# EAGLE design V1 (EAGLE 9.6.2)
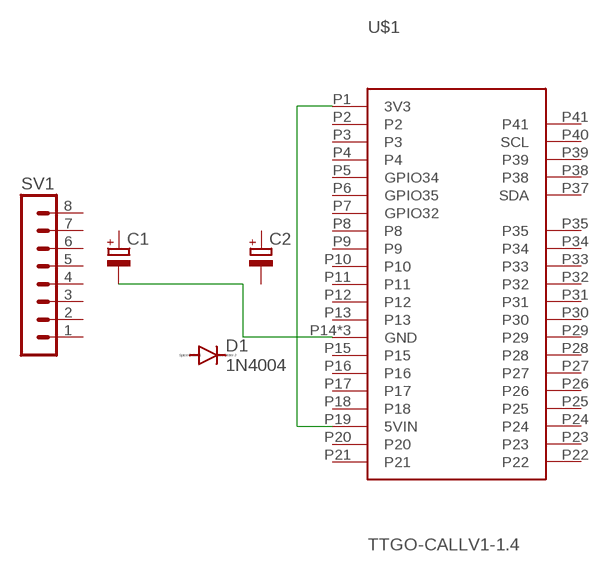
[diagram p0: schematic, sheet 1]

## Parts
C1  CPOL-EUE3.5-8  [E3,5-8]
C2  CPOL-EUE3.5-8  [E3,5-8]
D1  1N4004  [DO41-10]
SV1  MA08-1  [MA08-1]
U$1  TTGO-CALLV1-1.4  [TTGO-CALLV11.4]

## Nets
N$1: U$1.P1(3V3) U$1.P19(5VIN)
N$2: C1.- U$1.P14(GND) U$1.P36(GND) U$1.P42(GND)
Unconnected: C1.+ C2.+ C2.- D1.A D1.C SV1.1 SV1.2 SV1.3 SV1.4 SV1.5 SV1.6 SV1.7 SV1.8 U$1.P2 U$1.P3 U$1.P4 U$1.P5(GPIO34) U$1.P6(GPIO35) U$1.P7(GPIO32) U$1.P8 U$1.P9 U$1.P10 U$1.P11 U$1.P12 U$1.P13 U$1.P15 U$1.P16 U$1.P17 U$1.P18 U$1.P20 U$1.P21 U$1.P22 U$1.P23 U$1.P24 U$1.P25 U$1.P26 U$1.P27 U$1.P28 U$1.P29 U$1.P30 U$1.P31 U$1.P32 U$1.P33 U$1.P34 U$1.P35 U$1.P37(SDA) U$1.P38 U$1.P39 U$1.P40(SCL) U$1.P41

## Library data of the parts
C1 C2 = rcl:CPOL-EU: POLARIZED CAPACITOR, European symbol; SPICEPREFIX: C
D1 = diode:1N4004: DIODE general purpose rectifier, 1 A
SV1 = con-lstb:MA08-1: PIN HEADER; OC_FARNELL: unknown; OC_NEWARK: unknown
U$1 = TTGO T-Call V1.4:TTGO-CALLV1-1.4

## Board
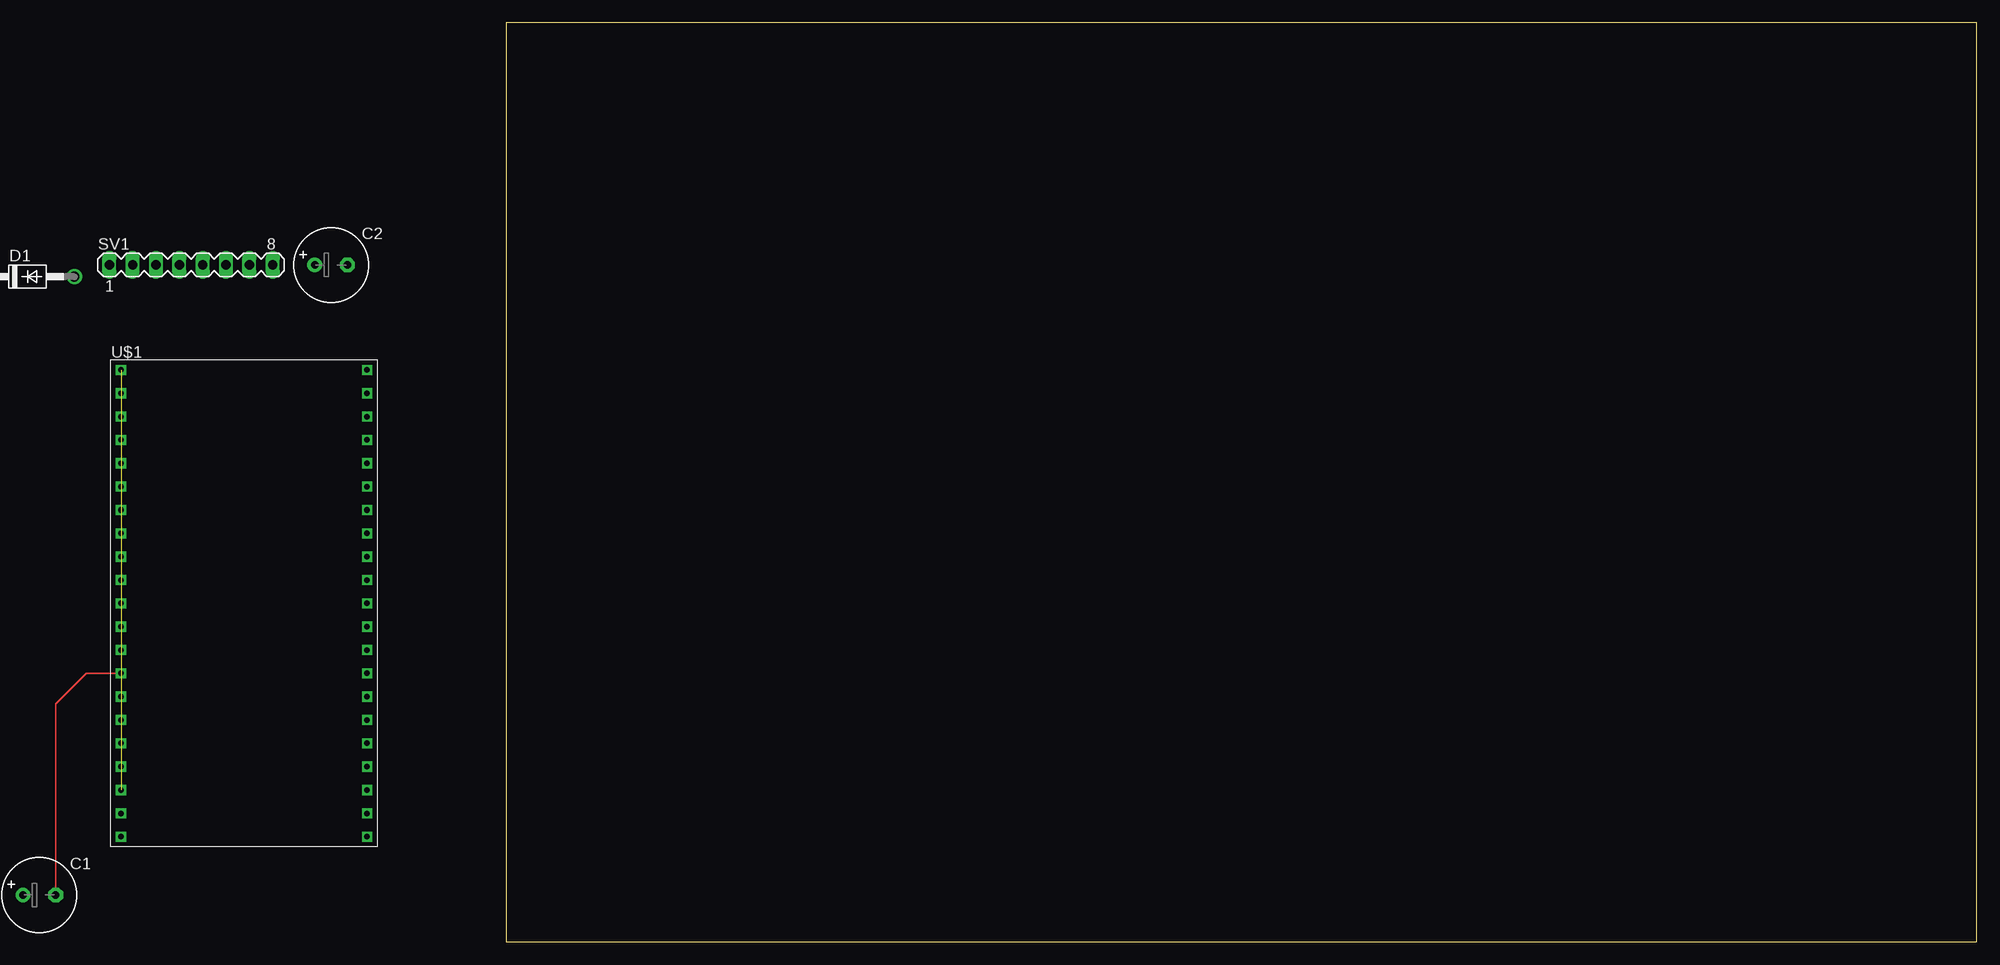
[diagram p1: board, top side]
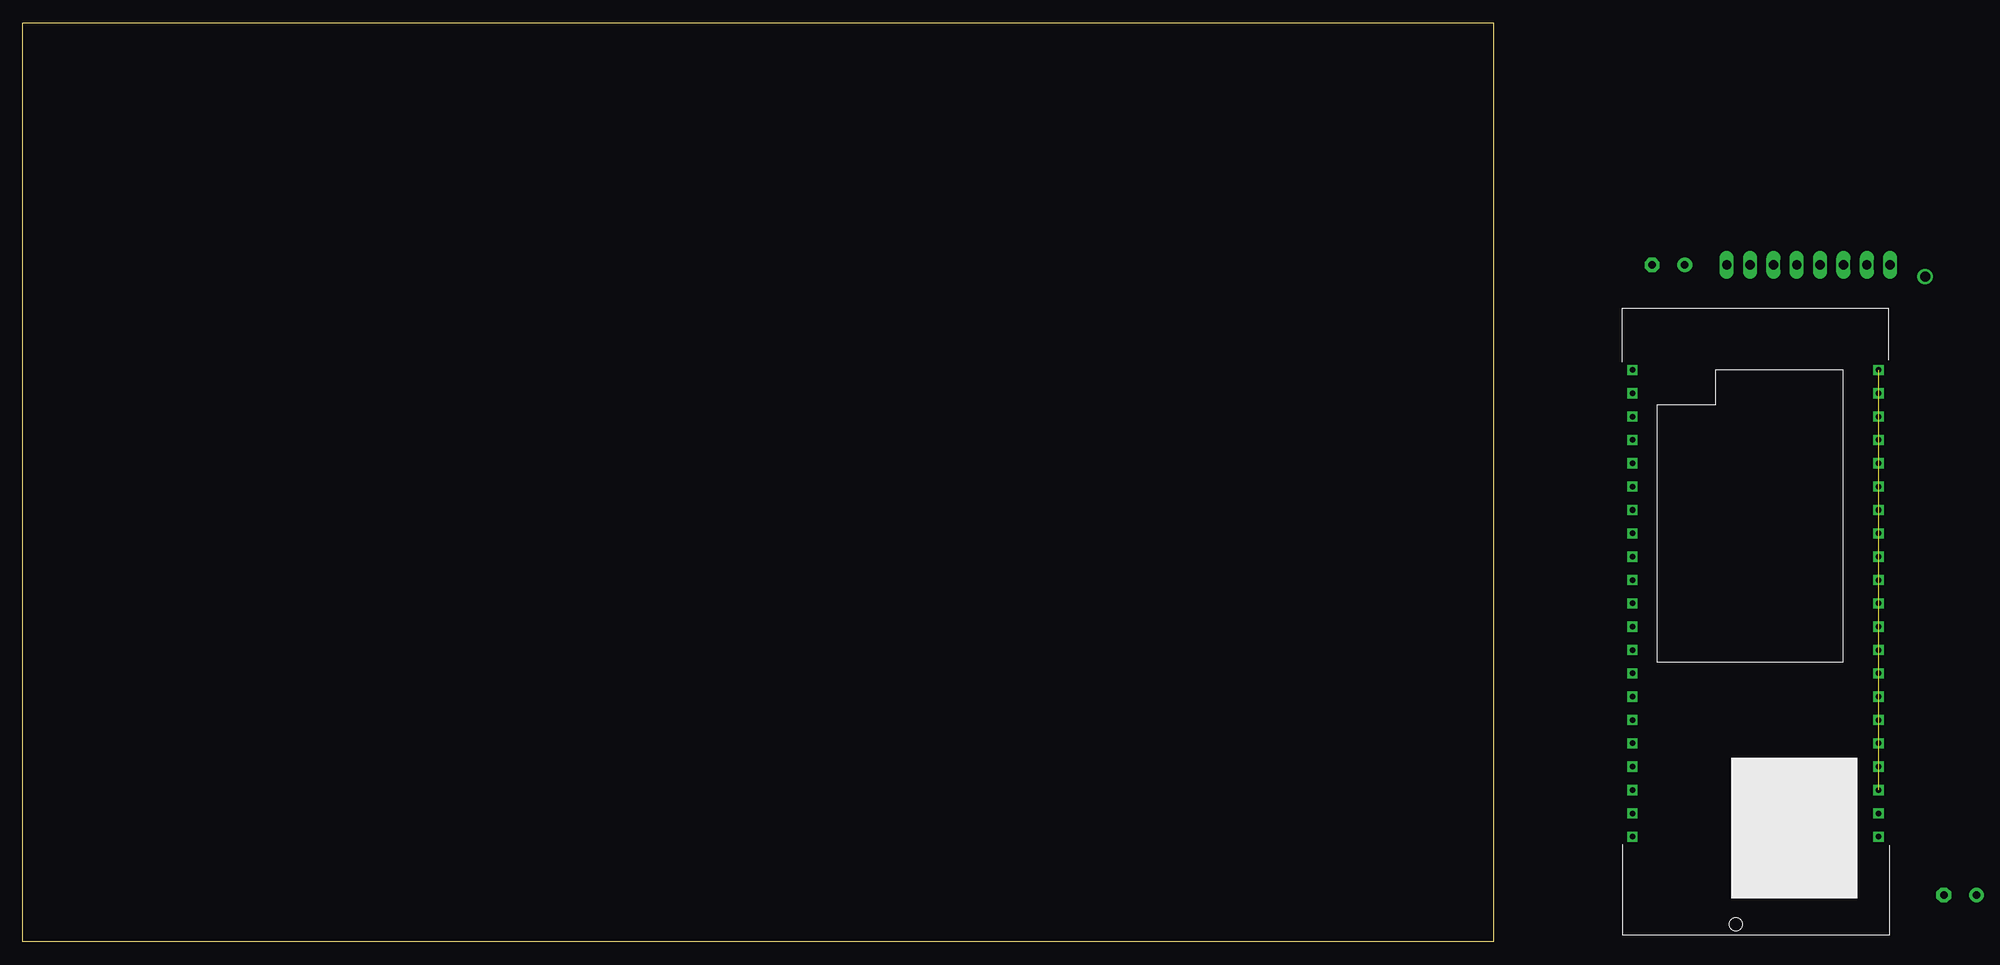
[diagram p2: board, bottom side, seen from below]

Size 160 x 100 mm. Coordinates in mm from the lower left corner, seen from the top.
Outline: 0,0 160,0 160,100 0,100 0,0
Copper layers (1*16): Top 0.035mm / dielectric 1.5mm / Bottom 0.035mm
Design rules "default": minimum track width 6mil, minimum drill 0.35mm, track to track 6mil, track to pad 6mil, pad to pad 6mil, via to via 6mil, smd to smd 6mil, copper to edge 40mil, drill to drill 6mil, minimum pad ring 10mil, minimum via ring 8mil, stop-mask expansion 4mil, vias tented up to drill 0mil, thermal gap 10mil

### Footprints (pad centres in the part's own frame; a part is rotated, then mirrored left to right if it is on the bottom)
E3,5-8 = drill 0.813 pad 1.6: + -1.778,0 | drill 0.813 pad 1.6 octagon: - 1.778,0
DO41-10 = drill 1.118: A 5.08,0; C -5.08,0
MA08-1 = drill 1.016 long: 1 -8.89,0; 2 -6.35,0; 3 -3.81,0; 4 -1.27,0; 5 1.27,0; 6 3.81,0; 7 6.35,0; 8 8.89,0
TTGO-CALLV11.4 = drill 0.6 square: P1 -12.7,11.43; P2 -12.7,8.89; P3 -12.7,6.35; P4 -12.7,3.81; P5 -12.7,1.27; P6 -12.7,-1.27; P7 -12.7,-3.81; P8 -12.7,-6.35; P9 -12.7,-8.89; P10 -12.7,-11.43; P11 -12.7,-13.97; P12 -12.7,-16.51; P13 -12.7,-19.05; P14 -12.7,-21.59; P15 -12.7,-24.13; P16 -12.7,-26.67; P17 -12.7,-29.21; P18 -12.7,-31.75; P19 -12.7,-34.29; P20 -12.7,-36.83; P21 -12.7,-39.37; P22 14.07,-39.37; P23 14.07,-36.83; P24 14.07,-34.29; P25 14.07,-31.75; P26 14.07,-29.21; P27 14.07,-26.67; P28 14.07,-24.13; P29 14.07,-21.59; P30 14.07,-19.05; P31 14.07,-16.51; P32 14.07,-13.97; P33 14.07,-11.43; P34 14.07,-8.89; P35 14.07,-6.35; P36 14.07,-3.81; P37 14.07,-1.27; P38 14.07,1.27; P39 14.07,3.81; P40 14.07,6.35; P41 14.07,8.89; P42 14.07,11.43

### Placement (x,y rotation side)
C1  -50.8,5.08 0 top  (outside the outline)
C2  -19.05,73.66 0 top  (outside the outline)
D1  -52.07,72.39 0 top  (outside the outline)
SV1  -34.29,73.66 0 top  (outside the outline)
U$1  -29.21,50.8 0 top  (outside the outline)

### Tracks (layer width: path | path; a pad name or v marks a point on that pad's centre or on a via)
N$1  (1 unrouted)
N$2
  Top 0.152: C1.- -49.02,25.91 -45.72,29.21 U$1.P14